# Altium schematic sheet BLE.SchDoc
size A4; Organization: Altium Limited; Address1: L3, 12a Rodborough Rd; Address2: Frenchs Forest; Address3: NSW; Address4: Australia 2086
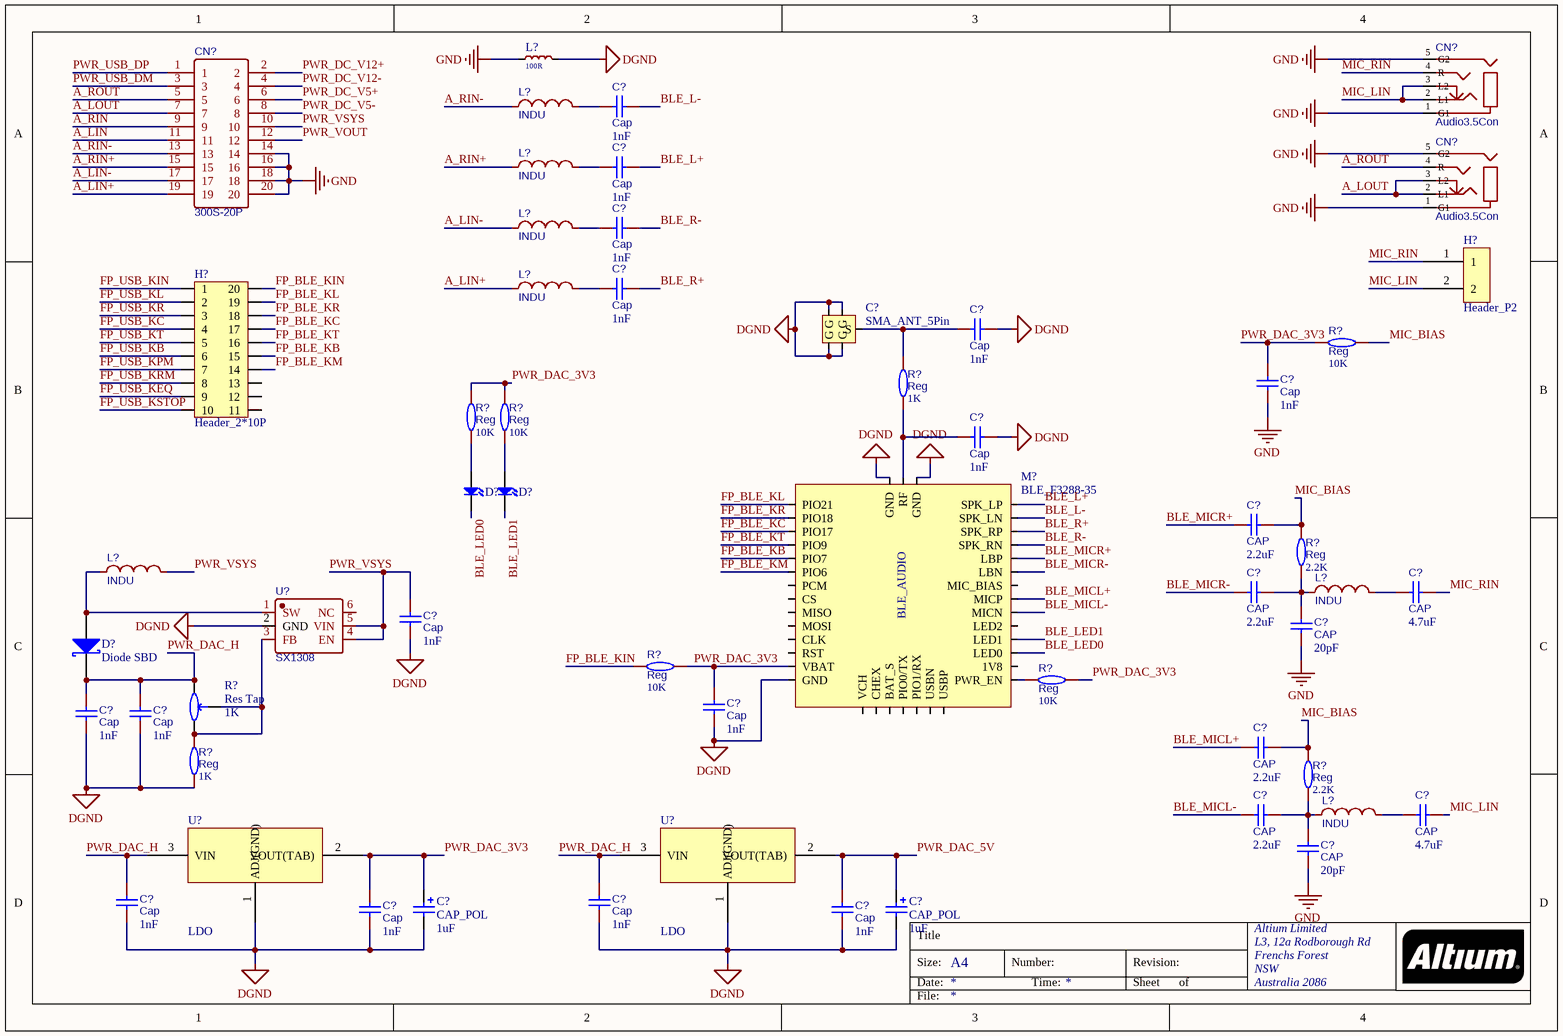
[diagram p0: BLE.SchDoc]

## Parts
(Parts that share a designator on the sheet are numbered #1, #2 ... from top to bottom, then left to right.)
C?#1  Cap  value 1nF  [C0603]
C?#2  Cap  value 1nF  [C0603]
C?#3  Cap  value 1nF  [C0603]
C?#4  Cap  value 1nF  [C0603]
C?#5  SMA_ANT_5Pin
C?#6  Cap  value 1nF  [C0603]
C?#7  Cap  value 1nF  [C0603]
C?#8  Cap  value 1nF  [C0603]
C?#9  CAP  value 2.2uF  [C0603]
C?#10  CAP  value 2.2uF  [C0603]
C?#11  CAP  value 4.7uF  [C0603]
C?#12  Cap  value 1nF  [C0603]
C?#13  CAP  value 20pF  [C0603]
C?#14  Cap  value 1nF  [C0603]
C?#15  Cap  value 1nF  [C0603]
C?#16  Cap  value 1nF  [C0603]
C?#17  CAP  value 2.2uF  [C0603]
C?#18  CAP  value 2.2uF  [C0603]
C?#19  CAP  value 4.7uF  [C0603]
C?#20  CAP  value 20pF  [C0603]
C?#21  Cap  value 1nF  [C0603]
C?#22  Cap  value 1nF  [C0603]
C?#23  Cap  value 1nF  [C0603]
C?#24  CAP_POL  value 1uF  [CAP_SMD_10mm]
C?#25  Cap  value 1nF  [C0603]
C?#26  CAP_POL  value 1uF  [CAP_SMD_10mm]
CN?#1  Audio3.5Con  [Audio3.5_3Pin]
CN?#2  300S-20P  [DC_20P_2.54]
CN?#3  Audio3.5Con  [Audio3.5_3Pin]
D?#1  LED  [LED0603]  (value not drawn)
D?#2  LED  [LED0603]  (value not drawn)
D?#3  Diode SBD  [SMA_L4.3]
H?#1  Header_P2  [H_1.27_P2]
H?#2  Header_2*10P  [H_2.0_2x10Pin_SMD]
L?#1  value 100R  [L0603]  (hidden comment: 电感磁珠)
L?#2  INDU  [SMD_L7.1]
L?#3  INDU  [SMD_L7.1]
L?#4  INDU  [SMD_L7.1]
L?#5  INDU  [SMD_L7.1]
L?#6  INDU  [SMD_L7.1]
L?#7  INDU  [SMD_L7.1]
L?#8  INDU  [SMD_L7.1]
M?  BLE_F3288-35
R?#1  Reg  value 10K  [R0603]
R?#2  Reg  value 1K  [R0603]
R?#3  Reg  value 10K  [R0603]
R?#4  Reg  value 10K  [R0603]
R?#5  Reg  value 2.2K  [R0603]
R?#6  Reg  value 10K  [R0603]
R?#7  Reg  value 10K  [R0603]
R?#8  Res Tap  value 1K  [Res_Tap_3296]
R?#9  Reg  value 1K  [R0603]
R?#10  Reg  value 2.2K  [R0603]
U?#1  SX1308  [SOT-23-6]
U?#2  LDO  [SOT-89]
U?#3  LDO  [SOT-89]

## Nets
DGND: C?#5.1(G) C?#5.2(G) C?#5.3(G) C?#5.4(G) C?#6.2 C?#8.2 C?#12.2 C?#14.2 C?#15.2 C?#16.2 C?#21.2 C?#22.2 C?#23.2 C?#24.2 C?#25.2 C?#26.2 L?#1.2 M?.14(GND) M?.36(GND) M?.38(GND) R?#9.1 U?#1.2(GND) U?#2.1(ADJ(GND)) U?#3.1(ADJ(GND))
GND: C?#7.1 C?#13.1 C?#20.1 CN?#1.1(G1) CN?#1.5(G2) CN?#2.14 CN?#2.16 CN?#2.18 CN?#2.20 CN?#3.1(G1) CN?#3.5(G2) L?#1.1
A_LIN: CN?#2.11
A_LIN+: CN?#2.19 L?#5.1
A_LIN-: CN?#2.17 L?#4.1
A_LOUT: CN?#2.7 CN?#3.2(L1) CN?#3.3(L2)
A_RIN: CN?#2.9
A_RIN+: CN?#2.15 L?#3.1
A_RIN-: CN?#2.13 L?#2.1
A_ROUT: CN?#2.5 CN?#3.4(R)
BLE_L+: C?#2.2 M?.35(SPK_LP)
BLE_L-: C?#1.2 M?.34(SPK_LN)
BLE_LED0: D?#1.1(K) M?.24(LED0)
BLE_LED1: D?#2.1(K) M?.25(LED1)
BLE_MICL+: C?#17.2 M?.28(MICP)
BLE_MICL-: C?#18.2 M?.27(MICN)
BLE_MICR+: C?#9.2 M?.31(LBP)
BLE_MICR-: C?#10.2 M?.30(LBN)
BLE_R+: C?#4.2 M?.33(SPK_RP)
BLE_R-: C?#3.2 M?.32(SPK_RN)
FP_BLE_KB: H?#2.15 M?.5(PIO7)
FP_BLE_KC: H?#2.17 M?.3(PIO17)
FP_BLE_KIN: H?#2.20 R?#6.2
FP_BLE_KL: H?#2.19 M?.1(PIO21)
FP_BLE_KM: H?#2.14 M?.6(PIO6)
FP_BLE_KR: H?#2.18 M?.2(PIO18)
FP_BLE_KT: H?#2.16 M?.4(PIO9)
FP_USB_KB: H?#2.6
FP_USB_KC: H?#2.4
FP_USB_KEQ: H?#2.9
FP_USB_KIN: H?#2.1
FP_USB_KL: H?#2.2
FP_USB_KPM: H?#2.7
FP_USB_KR: H?#2.3
FP_USB_KRM: H?#2.8
FP_USB_KSTOP: H?#2.10
FP_USB_KT: H?#2.5
MIC_BIAS: C?#9.1 C?#17.1 R?#1.1 R?#5.2 R?#10.2
MIC_LIN: C?#19.1 CN?#1.2(L1) CN?#1.3(L2) H?#1.2
MIC_RIN: C?#11.1 CN?#1.4(R) H?#1.1
PWR_DAC_3V3: C?#7.2 C?#14.1 C?#23.1 C?#24.1 M?.13(VBAT) R?#1.2 R?#3.2 R?#4.1 R?#6.1 R?#7.1 U?#2.2(VOUT(TAB))
PWR_DAC_5V: C?#25.1 C?#26.1 U?#3.2(VOUT(TAB))
PWR_DAC_H: C?#15.1 C?#16.1 C?#21.1 C?#22.1 D?#3.1(K) R?#8.1(A) U?#2.3(VIN) U?#3.3(VIN)
PWR_DC_V5+: CN?#2.6
PWR_DC_V5-: CN?#2.8
PWR_DC_V12+: CN?#2.2
PWR_DC_V12-: CN?#2.4
PWR_USB_DM: CN?#2.3
PWR_USB_DP: CN?#2.1
PWR_VOUT: CN?#2.12
PWR_VSYS: C?#12.1 CN?#2.10 L?#6.2 U?#1.4(EN) U?#1.5(VIN)
NetC?#1_1: C?#1.1 L?#2.2
NetC?#2_1: C?#2.1 L?#3.2
NetC?#3_1: C?#3.1 L?#4.2
NetC?#4_1: C?#4.1 L?#5.2
NetC?#5_5: C?#5.5(S) C?#6.1 R?#2.2
NetC?#8_1: C?#8.1 M?.37(RF) R?#2.1
NetC?#10_1: C?#10.1 C?#13.2 L?#7.1 R?#5.1
NetC?#11_2: C?#11.2 L?#7.2
NetC?#18_1: C?#18.1 C?#20.2 L?#8.1 R?#10.1
NetC?#19_2: C?#19.2 L?#8.2
NetD?#1_2: D?#1.2(A) R?#3.1
NetD?#2_2: D?#2.2(A) R?#4.2
NetD?#3_2: D?#3.2(A) L?#6.1 U?#1.1(SW)
NetM?_22: M?.22(PWR_EN) R?#7.2
NetR?#8_2: R?#8.2(B) R?#8.3(TAP) R?#9.2 U?#1.3(FB)

Not connected (* = marked no-connect by the designer): H?#2 11 12 13; M? 7(PCM) 8(CS) 9(MISO) 10(MOSI) 11(CLK) 12(RST) 15(VCH) 16(CHEX) 17(BAT_S) 18(PIO0/TX) 19(PIO1/RX) 20(USBN) 21(USBP) 23(1V8) 26(LED2) 29(MIC_BIAS); U?#1 6(NC)

## Notes on the sheet
- Title
- Size:
- Date:
- A4
- Number:
- Time:
- Revision:
- Sheet
- of
- File:
- (in symbol BLE_F3288-35) BLE_AUDIO

## Library data of the parts
C?#1-C?#4 C?#6-C?#23 C?#25 = CAP: BOM_Manufacturer: Huaxin S&T; BOM_Manufacturer Part: 0603B103K101CT; nameAlias: Capacitance; Contributor: LCSC; BOM_Supplier: LCSC; BOM_Supplier Part: C302008; spicePre: C; spiceSymbolName: 0603B103K101CT
C?#5 = SMA_ANT_5Pin: SMA射频天线座
C?#24 C?#26 = CAP_POL: 极性电容
CN?#1 CN?#3 = AudioCon3: 3.5mm 3Pin 音频接口; BOM_Manufacturer: G-Switch(品赞); BOM_Manufacturer Part: PJ-393; Contributor: LCSC; BOM_Supplier: LCSC; BOM_Supplier Part: C2837065; BOM_JLCPCB Part Class: Extended Part; spicePre: C; spiceSymbolName: PJ-393_C2837065
CN?#2 = DC-20P: DC牛角座，20P; BOM_Manufacturer: Shenzhen Cankemeng; Contributor: LCSC; BOM_Supplier: LCSC; BOM_Supplier Part: C132442; BOM_Manufacturer Part: -; BOM_JLCPCB Part Class: Extended Part; spicePre: C; spiceSymbolName: 300S-20P
D?#1 D?#2 = LED0: Published: 8-Jun-2000; LatestRevisionDate: 08-Jul-2005; LatestRevisionNote: Mech Layer 1 removed.; PackageReference: LED-0; Publisher: Altium Limited; PackageDescription: LED; 2 Leads
D?#3 = Diode SBD: Schottky Rectifier; Note: Terminal 2 is the TAB and is electrically connected to the cathode; Published: 8-Jun-2000; LatestRevisionDate: 17-Jul-2002; LatestRevisionNote: Re-released for DXP Platform.; DatasheetVersion: PD-2.057B; PackageVersion: Feb-1998; PackageReference: TO-220AC; Publisher: Altium Limited; PackageDescription: TO, Thru-Hole, Vertical, Heatsink Mounted; 3 In-Line Leads (1 Absent); Pitch 2.54 mm; ComponentLink1Description: Manufacturer Link; ComponentLink1URL: http://www.irf.com/; ComponentLink2Description: Datasheet; ComponentLink2URL: http://www.irf.com/product-info/datasheets/data/10tq.pdf
H?#1 = Header_P2: 2Pin排针
H?#2 = Header_2*10P: 2*10P连接器
L?#1 = IND_FB
L?#2-L?#8 = IND: 电感; BOM_Manufacturer: Sunltech Tech; BOM_Manufacturer Part: SLO0630H150MTT; nameAlias: Inductance; Contributor: LCSC; BOM_Supplier: LCSC; BOM_Supplier Part: C182182; BOM_JLCPCB Part Class: Extended Part; spicePre: L; spiceSymbolName: SLO0630H150MTT; Value: *
M? = BLE_F3288-35: 蓝牙音频
R?#1-R?#7 R?#9 R?#10 = Res: 电阻; BOM_Manufacturer: Viking Tech; BOM_Manufacturer Part: AR03BTCX1002A; nameAlias: Resistance (Ohms); Contributor: LCSC; BOM_Supplier: LCSC; BOM_Supplier Part: C465721; spicePre: R; spiceSymbolName: AR03BTCX1002A
R?#8 = Res Tap: 可调电阻; Sim Note: Enter the Resistance value and the set point into parameter fields.; Set Position: 0.5; Published: 24-Mar-1999; LatestRevisionDate: 17-Jul-2002; LatestRevisionNote: Re-released for DXP Platform.; PackageReference: VR3; Publisher: Altium Limited; PackageDescription: Variable Resistor, Thru-Hole; 3 Leads
U?#1 = SX1308: 升压PWM; BOM_Manufacturer: SX; sourceId: g4Yg9rJ1j; timeStamp: 1472247539; BOM_Supplier: LCSC; BOM_Manufacturer Part: SX1308; BOM_Supplier Part: C78162; BOM_JLCPCB Part Class: Extended Part; spicePre: U; spiceSymbolName: SX1308
U?#2 U?#3 = AMS1117